# Altium schematic sheet PS_DDR4_SODIMM.SchDoc
size A3
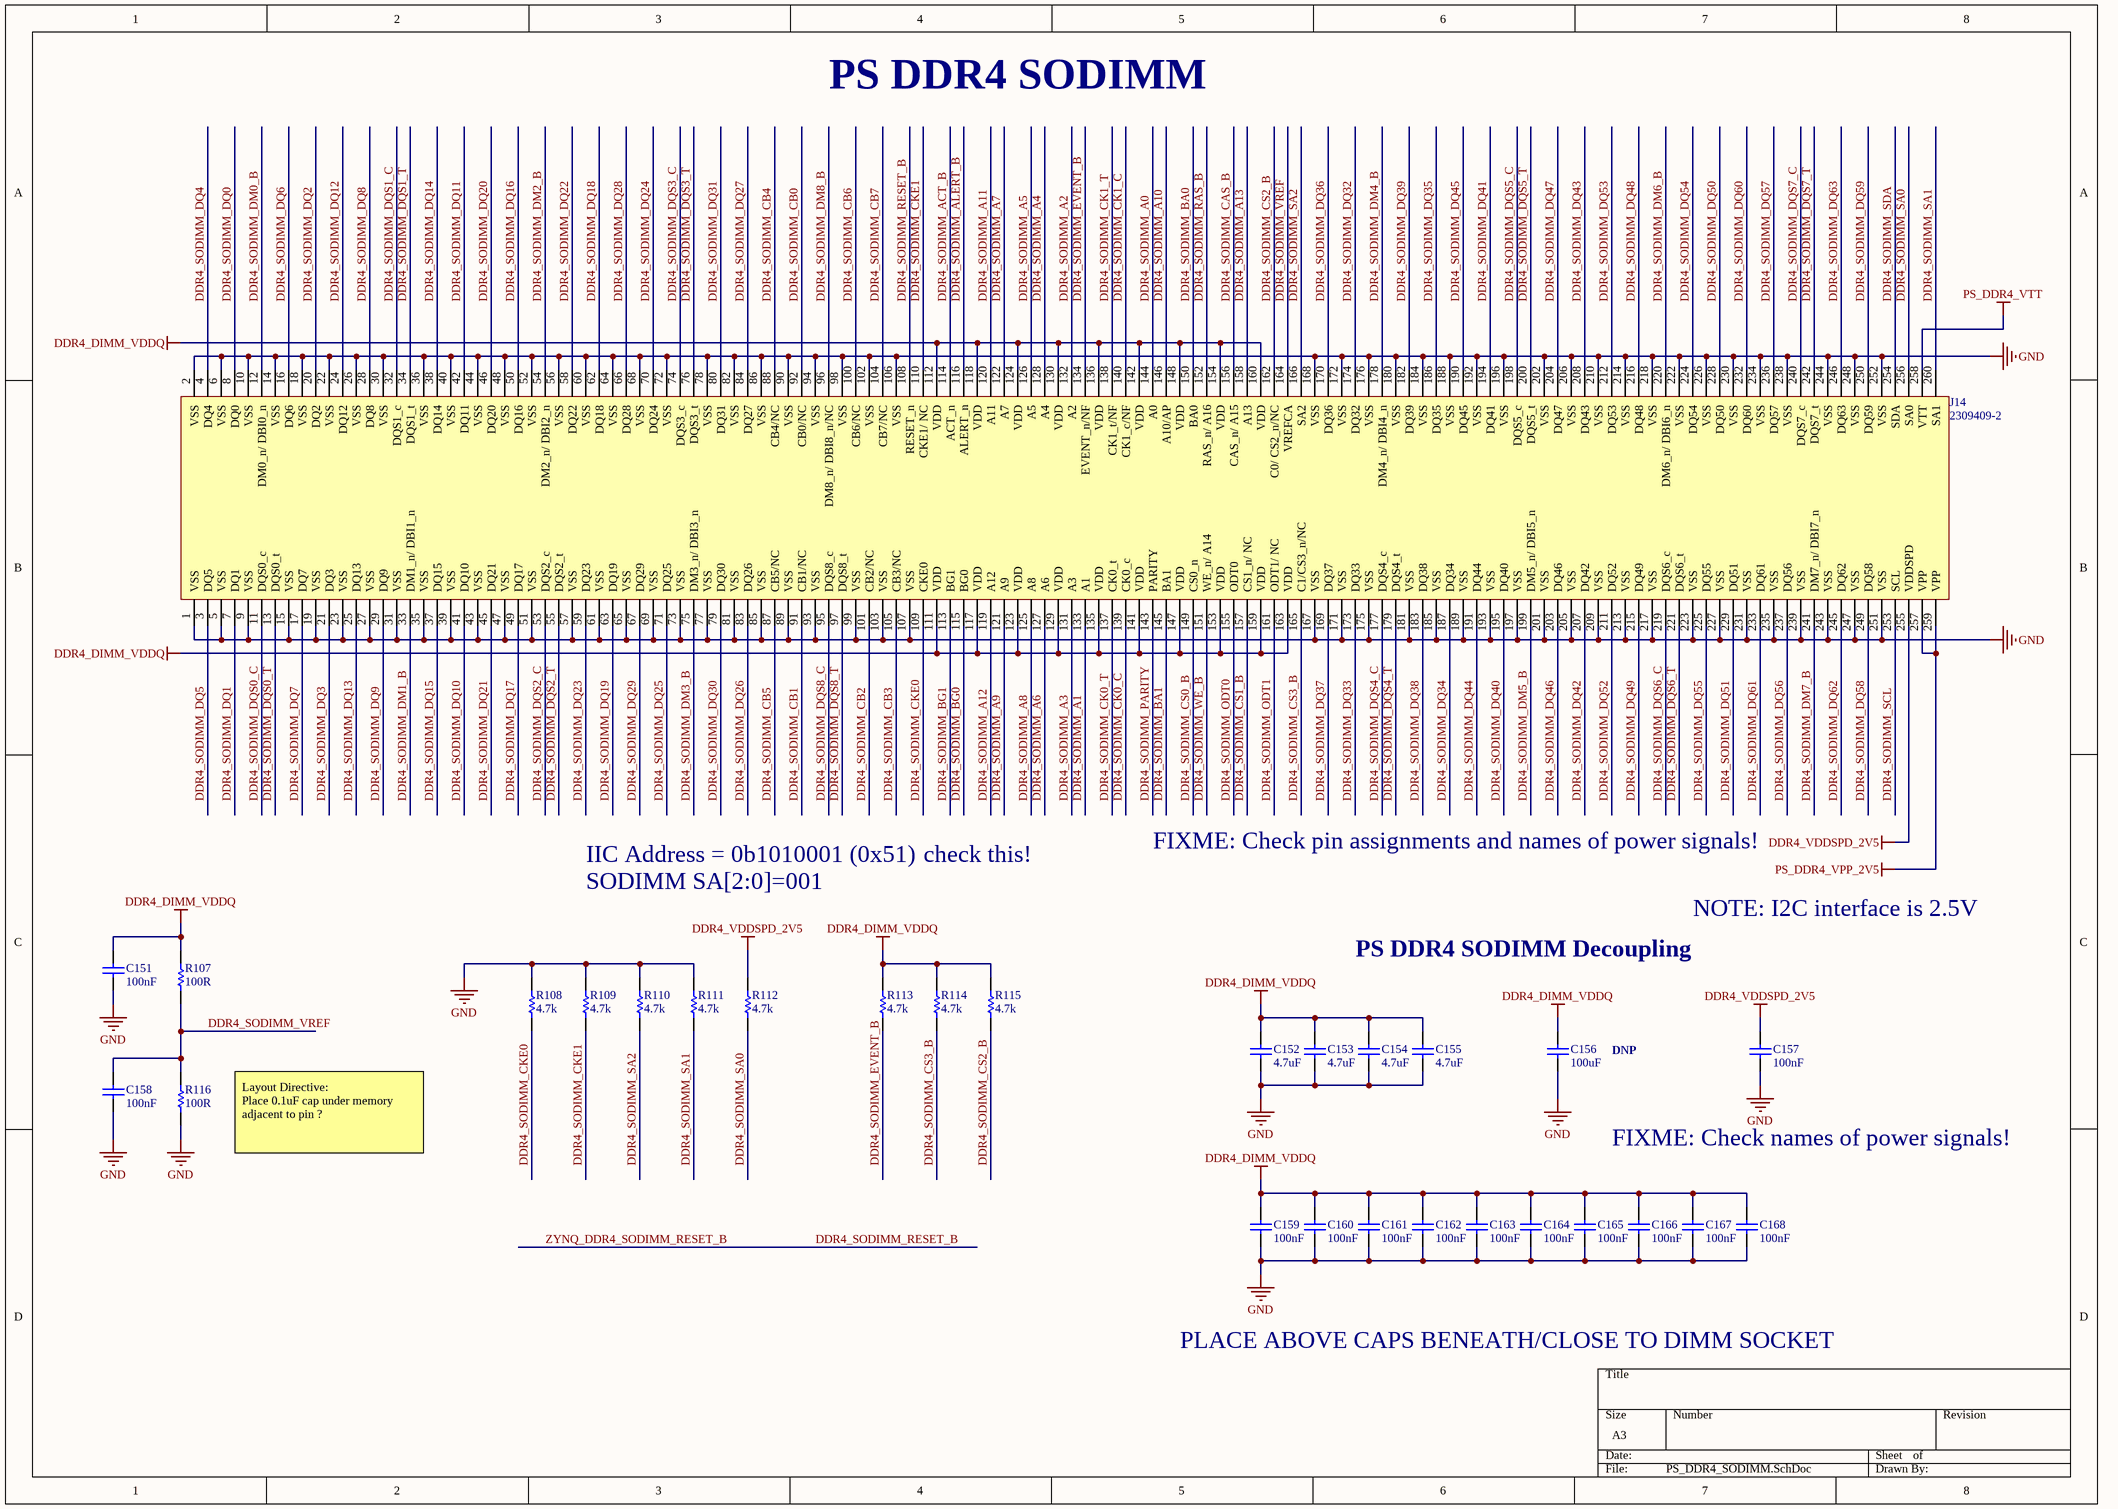
[diagram p0: PS_DDR4_SODIMM.SchDoc]

## Parts
C151  100nF  [CAPC1005L_0402]
C152  4.7uF  [CAPC1005L_0402]
C153  4.7uF  [CAPC1005L_0402]
C154  4.7uF  [CAPC1005L_0402]
C155  4.7uF  [CAPC1005L_0402]
C156  100uF  [CAPC3225N_1210]
C157  100nF  [CAPC1005L_0402]
C158  100nF  [CAPC1005L_0402]
C159  100nF  [CAPC1005L_0402]
C160  100nF  [CAPC1005L_0402]
C161  100nF  [CAPC1005L_0402]
C162  100nF  [CAPC1005L_0402]
C163  100nF  [CAPC1005L_0402]
C164  100nF  [CAPC1005L_0402]
C165  100nF  [CAPC1005L_0402]
C166  100nF  [CAPC1005L_0402]
C167  100nF  [CAPC1005L_0402]
C168  100nF  [CAPC1005L_0402]
J14  2309409-2  [DDR4_SODIMM_MATING]
R107  value 100R  [RESC1005L_0402]  (hidden comment: RES0402_100R_0W1_1T)
R108  value 4.7k  [RESC1005L_0402]  (hidden comment: RES0402_4K7_0W1_1T)
R109  value 4.7k  [RESC1005L_0402]  (hidden comment: RES0402_4K7_0W1_1T)
R110  value 4.7k  [RESC1005L_0402]  (hidden comment: RES0402_4K7_0W1_1T)
R111  value 4.7k  [RESC1005L_0402]  (hidden comment: RES0402_4K7_0W1_1T)
R112  value 4.7k  [RESC1005L_0402]  (hidden comment: RES0402_4K7_0W1_1T)
R113  value 4.7k  [RESC1005L_0402]  (hidden comment: RES0402_4K7_0W1_1T)
R114  value 4.7k  [RESC1005L_0402]  (hidden comment: RES0402_4K7_0W1_1T)
R115  value 4.7k  [RESC1005L_0402]  (hidden comment: RES0402_4K7_0W1_1T)
R116  value 100R  [RESC1005L_0402]  (hidden comment: RES0402_100R_0W1_1T)

## Nets
DDR4_DIMM_VDDQ: C151.2 C152.2 C153.2 C154.2 C155.2 C156.2 C159.2 C160.2 C161.2 C162.2 C163.2 C164.2 C165.2 C166.2 C167.2 C168.2 J14.111(VDD) J14.112(VDD) J14.117(VDD) J14.118(VDD) J14.123(VDD) J14.124(VDD) J14.129(VDD) J14.130(VDD) J14.135(VDD) J14.136(VDD) J14.141(VDD) J14.142(VDD) J14.147(VDD) J14.148(VDD) J14.153(VDD) J14.154(VDD) J14.159(VDD) J14.160(VDD) J14.163(VDD) R107.2 R113.2 R114.2 R115.2
DDR4_VDDSPD_2V5: C157.2 J14.255(VDDSPD) R112.2
GND: C151.1 C152.1 C153.1 C154.1 C155.1 C156.1 C157.1 C158.1 C159.1 C160.1 C161.1 C162.1 C163.1 C164.1 C165.1 C166.1 C167.1 C168.1 J14.1(VSS) J14.2(VSS) J14.5(VSS) J14.6(VSS) J14.9(VSS) J14.10(VSS) J14.14(VSS) J14.15(VSS) J14.18(VSS) J14.19(VSS) J14.22(VSS) J14.23(VSS) J14.26(VSS) J14.27(VSS) J14.30(VSS) J14.31(VSS) J14.35(VSS) J14.36(VSS) J14.39(VSS) J14.40(VSS) J14.43(VSS) J14.44(VSS) J14.47(VSS) J14.48(VSS) J14.51(VSS) J14.52(VSS) J14.56(VSS) J14.57(VSS) J14.60(VSS) J14.61(VSS) J14.64(VSS) J14.65(VSS) J14.68(VSS) J14.69(VSS) J14.72(VSS) J14.73(VSS) J14.77(VSS) J14.78(VSS) J14.81(VSS) J14.82(VSS) J14.85(VSS) J14.86(VSS) J14.89(VSS) J14.90(VSS) J14.93(VSS) J14.94(VSS) J14.98(VSS) J14.99(VSS) J14.102(VSS) J14.103(VSS) J14.106(VSS) J14.107(VSS) J14.167(VSS) J14.168(VSS) J14.171(VSS) J14.172(VSS) J14.175(VSS) J14.176(VSS) J14.180(VSS) J14.181(VSS) J14.184(VSS) J14.185(VSS) J14.188(VSS) J14.189(VSS) J14.192(VSS) J14.193(VSS) J14.196(VSS) J14.197(VSS) J14.201(VSS) J14.202(VSS) J14.205(VSS) J14.206(VSS) J14.209(VSS) J14.210(VSS) J14.213(VSS) J14.214(VSS) J14.217(VSS) J14.218(VSS) J14.222(VSS) J14.223(VSS) J14.226(VSS) J14.227(VSS) J14.230(VSS) J14.231(VSS) J14.234(VSS) J14.235(VSS) J14.238(VSS) J14.239(VSS) J14.243(VSS) J14.244(VSS) J14.247(VSS) J14.248(VSS) J14.251(VSS) J14.252(VSS) R108.2 R109.2 R110.2 R111.2 R116.1
PS_DDR4_VPP_2V5: J14.257(VPP) J14.259(VPP)
PS_DDR4_VTT: J14.258(VTT)
DDR4_SODIMM_A0: J14.144(A0)
DDR4_SODIMM_A1: J14.133(A1)
DDR4_SODIMM_A2: J14.132(A2)
DDR4_SODIMM_A3: J14.131(A3)
DDR4_SODIMM_A4: J14.128(A4)
DDR4_SODIMM_A5: J14.126(A5)
DDR4_SODIMM_A6: J14.127(A6)
DDR4_SODIMM_A7: J14.122(A7)
DDR4_SODIMM_A8: J14.125(A8)
DDR4_SODIMM_A9: J14.121(A9)
DDR4_SODIMM_A10: J14.146(A10/AP)
DDR4_SODIMM_A11: J14.120(A11)
DDR4_SODIMM_A12: J14.119(A12)
DDR4_SODIMM_A13: J14.158(A13)
DDR4_SODIMM_ACT_B: J14.114(ACT_n)
DDR4_SODIMM_ALERT_B: J14.116(ALERT_n)
DDR4_SODIMM_BA0: J14.150(BA0)
DDR4_SODIMM_BA1: J14.145(BA1)
DDR4_SODIMM_BG0: J14.115(BG0)
DDR4_SODIMM_BG1: J14.113(BG1)
DDR4_SODIMM_CAS_B: J14.156(CAS_n/_A15)
DDR4_SODIMM_CB0: J14.92(CB0/NC)
DDR4_SODIMM_CB1: J14.91(CB1/NC)
DDR4_SODIMM_CB2: J14.101(CB2/NC)
DDR4_SODIMM_CB3: J14.105(CB3/NC)
DDR4_SODIMM_CB4: J14.88(CB4/NC)
DDR4_SODIMM_CB5: J14.87(CB5/NC)
DDR4_SODIMM_CB6: J14.100(CB6/NC)
DDR4_SODIMM_CB7: J14.104(CB7/NC)
DDR4_SODIMM_CK0_C: J14.139(CK0_c)
DDR4_SODIMM_CK0_T: J14.137(CK0_t)
DDR4_SODIMM_CK1_C: J14.140(CK1_c/NF)
DDR4_SODIMM_CK1_T: J14.138(CK1_t/NF)
DDR4_SODIMM_CKE0: J14.109(CKE0) R108.1
DDR4_SODIMM_CKE1: J14.110(CKE1/_NC) R109.1
DDR4_SODIMM_CS0_B: J14.149(CS0_n)
DDR4_SODIMM_CS1_B: J14.157(CS1_n/_NC)
DDR4_SODIMM_CS2_B: J14.162(C0/_CS2_n/NC) R115.1
DDR4_SODIMM_CS3_B: J14.165(C1/CS3_n/NC) R114.1
DDR4_SODIMM_DM0_B: J14.12(DM0_n/_DBI0_n)
DDR4_SODIMM_DM1_B: J14.33(DM1_n/_DBI1_n)
DDR4_SODIMM_DM2_B: J14.54(DM2_n/_DBI2_n)
DDR4_SODIMM_DM3_B: J14.75(DM3_n/_DBI3_n)
DDR4_SODIMM_DM4_B: J14.178(DM4_n/_DBI4_n)
DDR4_SODIMM_DM5_B: J14.199(DM5_n/_DBI5_n)
DDR4_SODIMM_DM6_B: J14.220(DM6_n/_DBI6_n)
DDR4_SODIMM_DM7_B: J14.241(DM7_n/_DBI7_n)
DDR4_SODIMM_DM8_B: J14.96(DM8_n/_DBI8_n/NC)
DDR4_SODIMM_DQ0: J14.8(DQ0)
DDR4_SODIMM_DQ1: J14.7(DQ1)
DDR4_SODIMM_DQ2: J14.20(DQ2)
DDR4_SODIMM_DQ3: J14.21(DQ3)
DDR4_SODIMM_DQ4: J14.4(DQ4)
DDR4_SODIMM_DQ5: J14.3(DQ5)
DDR4_SODIMM_DQ6: J14.16(DQ6)
DDR4_SODIMM_DQ7: J14.17(DQ7)
DDR4_SODIMM_DQ8: J14.28(DQ8)
DDR4_SODIMM_DQ9: J14.29(DQ9)
DDR4_SODIMM_DQ10: J14.41(DQ10)
DDR4_SODIMM_DQ11: J14.42(DQ11)
DDR4_SODIMM_DQ12: J14.24(DQ12)
DDR4_SODIMM_DQ13: J14.25(DQ13)
DDR4_SODIMM_DQ14: J14.38(DQ14)
DDR4_SODIMM_DQ15: J14.37(DQ15)
DDR4_SODIMM_DQ16: J14.50(DQ16)
DDR4_SODIMM_DQ17: J14.49(DQ17)
DDR4_SODIMM_DQ18: J14.62(DQ18)
DDR4_SODIMM_DQ19: J14.63(DQ19)
DDR4_SODIMM_DQ20: J14.46(DQ20)
DDR4_SODIMM_DQ21: J14.45(DQ21)
DDR4_SODIMM_DQ22: J14.58(DQ22)
DDR4_SODIMM_DQ23: J14.59(DQ23)
DDR4_SODIMM_DQ24: J14.70(DQ24)
DDR4_SODIMM_DQ25: J14.71(DQ25)
DDR4_SODIMM_DQ26: J14.83(DQ26)
DDR4_SODIMM_DQ27: J14.84(DQ27)
DDR4_SODIMM_DQ28: J14.66(DQ28)
DDR4_SODIMM_DQ29: J14.67(DQ29)
DDR4_SODIMM_DQ30: J14.79(DQ30)
DDR4_SODIMM_DQ31: J14.80(DQ31)
DDR4_SODIMM_DQ32: J14.174(DQ32)
DDR4_SODIMM_DQ33: J14.173(DQ33)
DDR4_SODIMM_DQ34: J14.187(DQ34)
DDR4_SODIMM_DQ35: J14.186(DQ35)
DDR4_SODIMM_DQ36: J14.170(DQ36)
DDR4_SODIMM_DQ37: J14.169(DQ37)
DDR4_SODIMM_DQ38: J14.183(DQ38)
DDR4_SODIMM_DQ39: J14.182(DQ39)
DDR4_SODIMM_DQ40: J14.195(DQ40)
DDR4_SODIMM_DQ41: J14.194(DQ41)
DDR4_SODIMM_DQ42: J14.207(DQ42)
DDR4_SODIMM_DQ43: J14.208(DQ43)
DDR4_SODIMM_DQ44: J14.191(DQ44)
DDR4_SODIMM_DQ45: J14.190(DQ45)
DDR4_SODIMM_DQ46: J14.203(DQ46)
DDR4_SODIMM_DQ47: J14.204(DQ47)
DDR4_SODIMM_DQ48: J14.216(DQ48)
DDR4_SODIMM_DQ49: J14.215(DQ49)
DDR4_SODIMM_DQ50: J14.228(DQ50)
DDR4_SODIMM_DQ51: J14.229(DQ51)
DDR4_SODIMM_DQ52: J14.211(DQ52)
DDR4_SODIMM_DQ53: J14.212(DQ53)
DDR4_SODIMM_DQ54: J14.224(DQ54)
DDR4_SODIMM_DQ55: J14.225(DQ55)
DDR4_SODIMM_DQ56: J14.237(DQ56)
DDR4_SODIMM_DQ57: J14.236(DQ57)
DDR4_SODIMM_DQ58: J14.249(DQ58)
DDR4_SODIMM_DQ59: J14.250(DQ59)
DDR4_SODIMM_DQ60: J14.232(DQ60)
DDR4_SODIMM_DQ61: J14.233(DQ61)
DDR4_SODIMM_DQ62: J14.245(DQ62)
DDR4_SODIMM_DQ63: J14.246(DQ63)
DDR4_SODIMM_DQS0_C: J14.11(DQS0_c)
DDR4_SODIMM_DQS0_T: J14.13(DQS0_t)
DDR4_SODIMM_DQS1_C: J14.32(DQS1_c)
DDR4_SODIMM_DQS1_T: J14.34(DQS1_t)
DDR4_SODIMM_DQS2_C: J14.53(DQS2_c)
DDR4_SODIMM_DQS2_T: J14.55(DQS2_t)
DDR4_SODIMM_DQS3_C: J14.74(DQS3_c)
DDR4_SODIMM_DQS3_T: J14.76(DQS3_t)
DDR4_SODIMM_DQS4_C: J14.177(DQS4_c)
DDR4_SODIMM_DQS4_T: J14.179(DQS4_t)
DDR4_SODIMM_DQS5_C: J14.198(DQS5_c)
DDR4_SODIMM_DQS5_T: J14.200(DQS5_t)
DDR4_SODIMM_DQS6_C: J14.219(DQS6_c)
DDR4_SODIMM_DQS6_T: J14.221(DQS6_t)
DDR4_SODIMM_DQS7_C: J14.240(DQS7_c)
DDR4_SODIMM_DQS7_T: J14.242(DQS7_t)
DDR4_SODIMM_DQS8_C: J14.95(DQS8_c)
DDR4_SODIMM_DQS8_T: J14.97(DQS8_t)
DDR4_SODIMM_EVENT_B: J14.134(EVENT_n/NF) R113.1
DDR4_SODIMM_ODT0: J14.155(ODT0)
DDR4_SODIMM_ODT1: J14.161(ODT1/_NC)
DDR4_SODIMM_PARITY: J14.143(PARITY)
DDR4_SODIMM_RAS_B: J14.152(RAS_n/_A16)
DDR4_SODIMM_RESET_B: J14.108(RESET_n)  [also labelled ZYNQ_DDR4_SODIMM_RESET_B]
DDR4_SODIMM_SA0: J14.256(SA0) R112.1
DDR4_SODIMM_SA1: J14.260(SA1) R111.1
DDR4_SODIMM_SA2: J14.166(SA2) R110.1
DDR4_SODIMM_SCL: J14.253(SCL)
DDR4_SODIMM_SDA: J14.254(SDA)
DDR4_SODIMM_VREF: C158.2 J14.164(VREFCA) R107.1 R116.2
DDR4_SODIMM_WE_B: J14.151(WE_n/_A14)

## Notes on the sheet
- PS DDR4 SODIMM
- FIXME: Check pin assignments and names of power signals!
- IIC Address = 0b1010001 (0x51)
- SODIMM SA[2:0]=001
- check this!
- NOTE: I2C interface is 2.5V
- PS DDR4 SODIMM Decoupling
- DNP
- Layout Directive:
  Place 0.1uF cap under memory
  adjacent to pin ?
- FIXME: Check names of power signals!
- PLACE ABOVE CAPS BENEATH/CLOSE TO DIMM SOCKET

## Library data of the parts
C151 C157-C168 = CAPCER0402X7R100N25V_10T: CAP CER 0.1UF 25V X7R 0402; Manufacturer 1: Murata Electronics North America; Manufacturer Part Number 1: GRM155R71E104KE14D; Tolerance: 10%; Package: 0402; ComponentLink1Description: Datasheet; Value: 100nF; Voltage: 25V; Temperature Coefficient: X7R; Supplier 1: Digi-Key; Supplier Part Number 1: 490-10698-1-ND; Operating Temperature: -55°C ~ 125°C
C152-C155 = CAPCER0402X5R4U710V_10T: CAP CER 4.7UF 10V X5R 0402; Manufacturer 1: TDK Corporation; Manufacturer Part Number 1: C1005X5R1A475K050BC; Tolerance: 10%; Package: 0402; ComponentLink1Description: Datasheet; Value: 4.7uF; Voltage: 10V; Temperature Coefficient: x5R; Supplier 1: Digi-Key; Supplier Part Number 1: 445-13820-1-ND; Operating Temperature: -55°C ~ 85°C
C156 = CAPCER1210X5R100U16V_20T: CAP CER 100UF 16V X5R 1210; Manufacturer 1: Taiyo Yuden; Manufacturer Part Number 1: EMK325ABJ107MM-T; Tolerance: 20%; Package: 1210; ComponentLink1Description: Datasheet; Value: 100uF; Voltage: 16V; Temperature Coefficient: X5R; Supplier 1: Digi-Key; Supplier Part Number 1: 587-3152-1-ND; Operating Temperature: -55°C ~ 85°C
J14 = 2309409-2: DDR4 SODIMM 260P 5.2H STD; Manufacturer 1: TE; ComponentLink1Description: Datasheet; ComponentLink1URL: C:\Users\Public\Documents\Altium\AD16\Library\PDF\ENG_CD_2309409_3.pdf; Supplier 1: Digi-Key; Manufacturer Part Number 1: 2309409-2; Operating Temperature: -55 – 85 °C; Height: 5.2mm
R107 R116 = RES0402_100R_0W1_1T: RES SMD 100 OHM 1% 1/10W 0402; Manufacturer 1: Panasonic Electronic Components; Manufacturer Part Number 1: ERJ-2RKF1000X; Package: 0402; ComponentLink1Description: Datasheet; Power: 1/10W; Tolerance: 1%; Supplier 1: Digi-Key; Supplier Part Number 1: P100LCT-ND
R108-R115 = RES0402_4K7_0W1_1T: RES SMD 4.7K OHM 1% 1/10W 0402; Manufacturer 1: Panasonic Electronic Components; Manufacturer Part Number 1: ERJ-2RKF4701X; Package: 0402; ComponentLink1Description: Datasheet; Power: 1/10W; Tolerance: 1%; Supplier 1: Digi-Key; Supplier Part Number 1: P4.70KLCT-ND